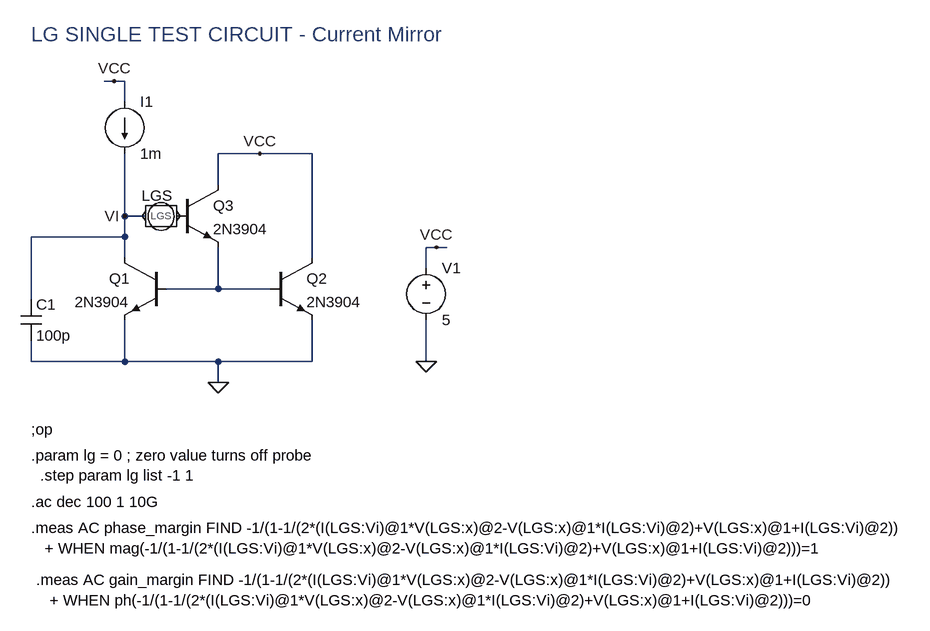
[diagram p0: schematic LG Single test circuit 1.asc]
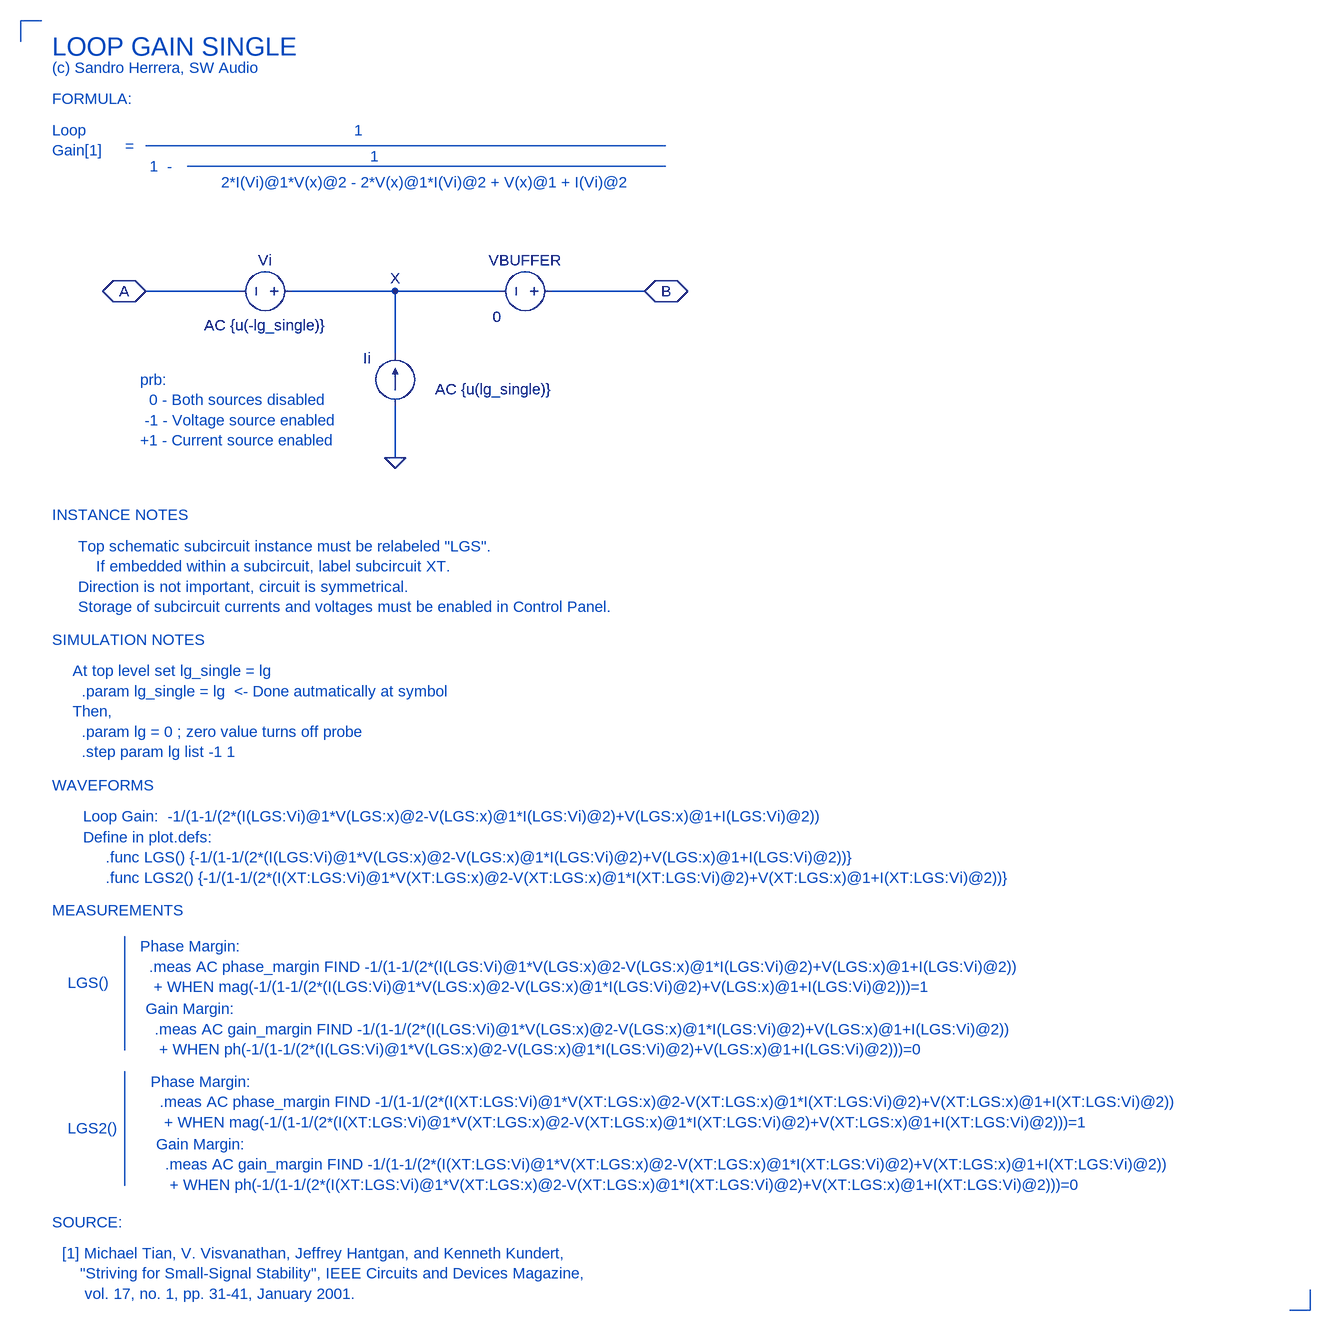
[diagram p1: sub-circuit lg_single.asc]
LG Single test circuit 1.asc, the LTspice schematic file:
Version 4
SHEET 1 1432 940
WIRE 96 128 80 128
WIRE 112 128 96 128
WIRE 112 160 112 128
WIRE 320 240 256 240
WIRE 400 240 320 240
WIRE 256 288 256 240
WIRE 112 336 112 240
WIRE 144 336 112 336
WIRE 112 368 112 336
WIRE 112 368 -32 368
WIRE 592 384 576 384
WIRE 608 384 592 384
WIRE 112 400 112 368
WIRE 400 400 400 240
WIRE 576 416 576 384
WIRE 256 448 256 384
WIRE 256 448 176 448
WIRE 336 448 256 448
WIRE -32 464 -32 368
WIRE -32 560 -32 528
WIRE 112 560 112 496
WIRE 112 560 -32 560
WIRE 256 560 112 560
WIRE 400 560 400 496
WIRE 400 560 256 560
WIRE 576 560 576 496
WIRE 256 592 256 560
FLAG 320 240 VCC
FLAG 96 128 VCC
FLAG 256 592 0
FLAG 576 560 0
FLAG 592 384 VCC
FLAG 112 336 VI
SYMBOL current 112 160 R0
WINDOW 123 0 0 Left 0
WINDOW 39 0 0 Left 0
SYMATTR InstName I1
SYMATTR Value 1m
SYMBOL npn 176 400 M0
SYMATTR InstName Q1
SYMATTR Value 2N3904
SYMBOL npn 336 400 R0
SYMATTR InstName Q2
SYMATTR Value 2N3904
SYMBOL npn 192 288 R0
SYMATTR InstName Q3
SYMATTR Value 2N3904
SYMBOL voltage 576 400 R0
WINDOW 123 0 0 Left 0
WINDOW 39 0 0 Left 0
SYMATTR InstName V1
SYMATTR Value 5
SYMBOL cap -48 464 R0
SYMATTR InstName C1
SYMATTR Value 100p
SYMBOL MySymbols\\LG_single 176 336 R0
SYMATTR InstName LGS
TEXT -32 56 Left 3 ;LG SINGLE TEST CIRCUIT - Current Mirror
TEXT -32 664 Left 2 !;op
TEXT -32 704 Left 2 !.param lg = 0 ; zero value turns off probe\n  .step param lg list -1 1
TEXT -32 776 Left 2 !.ac dec 100 1 10G
TEXT -32 816 Left 2 !.meas AC phase_margin FIND -1/(1-1/(2*(I(LGS:Vi)@1*V(LGS:x)@2-V(LGS:x)@1*I(LGS:Vi)@2)+V(LGS:x)@1+I(LGS:Vi)@2))\n   + WHEN mag(-1/(1-1/(2*(I(LGS:Vi)@1*V(LGS:x)@2-V(LGS:x)@1*I(LGS:Vi)@2)+V(LGS:x)@1+I(LGS:Vi)@2)))=1
TEXT -24 896 Left 2 !.meas AC gain_margin FIND -1/(1-1/(2*(I(LGS:Vi)@1*V(LGS:x)@2-V(LGS:x)@1*I(LGS:Vi)@2)+V(LGS:x)@1+I(LGS:Vi)@2))\n   + WHEN ph(-1/(1-1/(2*(I(LGS:Vi)@1*V(LGS:x)@2-V(LGS:x)@1*I(LGS:Vi)@2)+V(LGS:x)@1+I(LGS:Vi)@2)))=0

lg_single.asc, the sub-circuit schematic file:
Version 4
SHEET 1 1988 2148
WIRE 336 416 192 416
WIRE 576 416 416 416
WIRE 736 416 576 416
WIRE 960 416 816 416
WIRE 576 512 576 416
WIRE 576 672 576 592
FLAG 576 672 0
FLAG 192 416 A
IOPIN 192 416 BiDir
FLAG 960 416 B
IOPIN 960 416 BiDir
FLAG 576 416 X
SYMBOL current 576 592 R180
WINDOW 0 37 73 Left 2
WINDOW 3 24 0 Left 2
WINDOW 123 -243 25 Left 2
WINDOW 39 0 0 Left 0
SYMATTR InstName Ii
SYMATTR Value ""
SYMATTR Value2 AC {u(lg_single)}
SYMBOL voltage 432 416 R90
WINDOW 0 -32 56 VBottom 2
WINDOW 3 74 56 VTop 2
WINDOW 123 37 55 VTop 2
WINDOW 39 0 0 Left 0
SYMATTR InstName Vi
SYMATTR Value ""
SYMATTR Value2 AC {u(-lg_single)}
SYMBOL voltage 832 416 R90
WINDOW 0 -32 56 VBottom 2
WINDOW 3 55 99 VBottom 2
WINDOW 123 37 55 VTop 2
WINDOW 39 0 0 Left 0
SYMATTR InstName VBUFFER
SYMATTR Value 0
TEXT 48 40 Left 4 ;LOOP GAIN SINGLE
TEXT 520 168 Center 2 ;1
TEXT 544 208 Center 2 ;1
TEXT 624 248 Center 2 ;2*I(Vi)@1*V(x)@2 - 2*V(x)@1*I(Vi)@2 + V(x)@1 + I(Vi)@2
TEXT 216 224 Center 2 ;1  -
TEXT 48 168 Left 2 ;Loop\nGain[1]
TEXT 168 192 Center 2 ;=
TEXT 48 120 Left 2 ;FORMULA:
TEXT 184 552 Left 2 ;prb:\n  0 - Both sources disabled\n -1 - Voltage source enabled\n+1 - Current source enabled
TEXT 48 952 Left 2 ;SIMULATION NOTES
TEXT 80 1000 Left 2 ;At top level set lg_single = lg\n  .param lg_single = lg  <- Done autmatically at symbol \nThen,\n  .param lg = 0 ; zero value turns off probe\n  .step param lg list -1 1
TEXT 64 1896 Left 2 ;[1] Michael Tian, V. Visvanathan, Jeffrey Hantgan, and Kenneth Kundert,\n    "Striving for Small-Signal Stability", IEEE Circuits and Devices Magazine,\n     vol. 17, no. 1, pp. 31-41, January 2001.
TEXT 88 808 Left 2 ;Top schematic subcircuit instance must be relabeled "LGS".\n    If embedded within a subcircuit, label subcircuit XT.\nDirection is not important, circuit is symmetrical.\nStorage of subcircuit currents and voltages must be enabled in Control Panel.
TEXT 48 1176 Left 2 ;WAVEFORMS
TEXT 48 1848 Left 2 ;SOURCE:
TEXT 96 1224 Left 2 ;Loop Gain:  -1/(1-1/(2*(I(LGS:Vi)@1*V(LGS:x)@2-V(LGS:x)@1*I(LGS:Vi)@2)+V(LGS:x)@1+I(LGS:Vi)@2))
TEXT 96 1256 Left 2 ;Define in plot.defs:\n     .func LGS() {-1/(1-1/(2*(I(LGS:Vi)@1*V(LGS:x)@2-V(LGS:x)@1*I(LGS:Vi)@2)+V(LGS:x)@1+I(LGS:Vi)@2))}\n     .func LGS2() {-1/(1-1/(2*(I(XT:LGS:Vi)@1*V(XT:LGS:x)@2-V(XT:LGS:x)@1*I(XT:LGS:Vi)@2)+V(XT:LGS:x)@1+I(XT:LGS:Vi)@2))}
TEXT 48 760 Left 2 ;INSTANCE NOTES
TEXT 184 1424 Left 2 ;Phase Margin:\n  .meas AC phase_margin FIND -1/(1-1/(2*(I(LGS:Vi)@1*V(LGS:x)@2-V(LGS:x)@1*I(LGS:Vi)@2)+V(LGS:x)@1+I(LGS:Vi)@2))\n   + WHEN mag(-1/(1-1/(2*(I(LGS:Vi)@1*V(LGS:x)@2-V(LGS:x)@1*I(LGS:Vi)@2)+V(LGS:x)@1+I(LGS:Vi)@2)))=1
TEXT 192 1520 Left 2 ;Gain Margin:\n  .meas AC gain_margin FIND -1/(1-1/(2*(I(LGS:Vi)@1*V(LGS:x)@2-V(LGS:x)@1*I(LGS:Vi)@2)+V(LGS:x)@1+I(LGS:Vi)@2))\n   + WHEN ph(-1/(1-1/(2*(I(LGS:Vi)@1*V(LGS:x)@2-V(LGS:x)@1*I(LGS:Vi)@2)+V(LGS:x)@1+I(LGS:Vi)@2)))=0
TEXT 48 1368 Left 2 ;MEASUREMENTS
TEXT 200 1632 Left 2 ;Phase Margin:\n  .meas AC phase_margin FIND -1/(1-1/(2*(I(XT:LGS:Vi)@1*V(XT:LGS:x)@2-V(XT:LGS:x)@1*I(XT:LGS:Vi)@2)+V(XT:LGS:x)@1+I(XT:LGS:Vi)@2))\n   + WHEN mag(-1/(1-1/(2*(I(XT:LGS:Vi)@1*V(XT:LGS:x)@2-V(XT:LGS:x)@1*I(XT:LGS:Vi)@2)+V(XT:LGS:x)@1+I(XT:LGS:Vi)@2)))=1
TEXT 208 1728 Left 2 ;Gain Margin:\n  .meas AC gain_margin FIND -1/(1-1/(2*(I(XT:LGS:Vi)@1*V(XT:LGS:x)@2-V(XT:LGS:x)@1*I(XT:LGS:Vi)@2)+V(XT:LGS:x)@1+I(XT:LGS:Vi)@2))\n   + WHEN ph(-1/(1-1/(2*(I(XT:LGS:Vi)@1*V(XT:LGS:x)@2-V(XT:LGS:x)@1*I(XT:LGS:Vi)@2)+V(XT:LGS:x)@1+I(XT:LGS:Vi)@2)))=0
TEXT 72 1480 Left 2 ;LGS()
TEXT 72 1704 Left 2 ;LGS2()
TEXT 48 72 Left 2 ;(c) Sandro Herrera, SW Audio
LINE Normal 992 224 256 224
LINE Normal 0 0 0 32
LINE Normal 32 0 0 0
LINE Normal 32 0 32 0 2
LINE Normal 992 192 192 192
LINE Normal 1984 1984 1984 1952
LINE Normal 1952 1984 1984 1984
LINE Normal 1952 1984 1952 1984 2
LINE Normal 160 1584 160 1408
LINE Normal 160 1584 160 1584 2
LINE Normal 160 1792 160 1616
LINE Normal 160 1792 160 1792 2

The netlist it stands for:
* LG Single test circuit 1.asc
I1 VCC VI 1m
Q1 VI N001 0 0 2N3904
Q2 VCC N001 0 0 2N3904
Q3 VCC P001 N001 0 2N3904
V1 VCC 0 5
C1 VI 0 100p
XLGS VI P001 lg_single params: lg_single=lg

* block symbol definitions
.subckt lg_single A B
Ii 0 X AC {u(lg_single)}
Vi X A AC {u(-lg_single)}
VBUFFER B X 0
* LOOP GAIN SINGLE
* 1
* 1
* 2*I(Vi)@1*V(x)@2 - 2*V(x)@1*I(Vi)@2 + V(x)@1 + I(Vi)@2
* 1  -
* Loop
* Gain[1]
* =
* FORMULA:
* prb:
*   0 - Both sources disabled
*  -1 - Voltage source enabled
* +1 - Current source enabled
* SIMULATION NOTES
* At top level set lg_single = lg
*   .param lg_single = lg  <- Done autmatically at symbol
* Then,
*   .param lg = 0 ; zero value turns off probe
*   .step param lg list -1 1
* [1] Michael Tian, V. Visvanathan, Jeffrey Hantgan, and Kenneth Kundert,
*     "Striving for Small-Signal Stability", IEEE Circuits and Devices Magazine,
*      vol. 17, no. 1, pp. 31-41, January 2001.
* Top schematic subcircuit instance must be relabeled "LGS".
*     If embedded within a subcircuit, label subcircuit XT.
* Direction is not important, circuit is symmetrical.
* Storage of subcircuit currents and voltages must be enabled in Control Panel.
* WAVEFORMS
* SOURCE:
* Loop Gain:  -1/(1-1/(2*(I(LGS:Vi)@1*V(LGS:x)@2-V(LGS:x)@1*I(LGS:Vi)@2)+V(LGS:x)@1+I(LGS:Vi)@2))
* Define in plot.defs:
*      .func LGS() {-1/(1-1/(2*(I(LGS:Vi)@1*V(LGS:x)@2-V(LGS:x)@1*I(LGS:Vi)@2)+V(LGS:x)@1+I(LGS:Vi)@2))}
*      .func LGS2() {-1/(1-1/(2*(I(XT:LGS:Vi)@1*V(XT:LGS:x)@2-V(XT:LGS:x)@1*I(XT:LGS:Vi)@2)+V(XT:LGS:x)@1+I(XT:LGS:Vi)@2))}
* INSTANCE NOTES
* Phase Margin:
*   .meas AC phase_margin FIND -1/(1-1/(2*(I(LGS:Vi)@1*V(LGS:x)@2-V(LGS:x)@1*I(LGS:Vi)@2)+V(LGS:x)@1+I(LGS:Vi)@2))
*    + WHEN mag(-1/(1-1/(2*(I(LGS:Vi)@1*V(LGS:x)@2-V(LGS:x)@1*I(LGS:Vi)@2)+V(LGS:x)@1+I(LGS:Vi)@2)))=1
* Gain Margin:
*   .meas AC gain_margin FIND -1/(1-1/(2*(I(LGS:Vi)@1*V(LGS:x)@2-V(LGS:x)@1*I(LGS:Vi)@2)+V(LGS:x)@1+I(LGS:Vi)@2))
*    + WHEN ph(-1/(1-1/(2*(I(LGS:Vi)@1*V(LGS:x)@2-V(LGS:x)@1*I(LGS:Vi)@2)+V(LGS:x)@1+I(LGS:Vi)@2)))=0
* MEASUREMENTS
* Phase Margin:
*   .meas AC phase_margin FIND -1/(1-1/(2*(I(XT:LGS:Vi)@1*V(XT:LGS:x)@2-V(XT:LGS:x)@1*I(XT:LGS:Vi)@2)+V(XT:LGS:x)@1+I(XT:LGS:Vi)@2))
*    + WHEN mag(-1/(1-1/(2*(I(XT:LGS:Vi)@1*V(XT:LGS:x)@2-V(XT:LGS:x)@1*I(XT:LGS:Vi)@2)+V(XT:LGS:x)@1+I(XT:LGS:Vi)@2)))=1
* Gain Margin:
*   .meas AC gain_margin FIND -1/(1-1/(2*(I(XT:LGS:Vi)@1*V(XT:LGS:x)@2-V(XT:LGS:x)@1*I(XT:LGS:Vi)@2)+V(XT:LGS:x)@1+I(XT:LGS:Vi)@2))
*    + WHEN ph(-1/(1-1/(2*(I(XT:LGS:Vi)@1*V(XT:LGS:x)@2-V(XT:LGS:x)@1*I(XT:LGS:Vi)@2)+V(XT:LGS:x)@1+I(XT:LGS:Vi)@2)))=0
* LGS()
* LGS2()
* (c) Sandro Herrera, SW Audio
.ends lg_single

.model NPN NPN
.model PNP PNP
.lib standard.bjt
* LG SINGLE TEST CIRCUIT - Current Mirror
;op
.param lg = 0 ; zero value turns off probe
  .step param lg list -1 1
.ac dec 100 1 10G
.meas AC phase_margin FIND -1/(1-1/(2*(I(LGS:Vi)@1*V(LGS:x)@2-V(LGS:x)@1*I(LGS:Vi)@2)+V(LGS:x)@1+I(LGS:Vi)@2))
   + WHEN mag(-1/(1-1/(2*(I(LGS:Vi)@1*V(LGS:x)@2-V(LGS:x)@1*I(LGS:Vi)@2)+V(LGS:x)@1+I(LGS:Vi)@2)))=1
.meas AC gain_margin FIND -1/(1-1/(2*(I(LGS:Vi)@1*V(LGS:x)@2-V(LGS:x)@1*I(LGS:Vi)@2)+V(LGS:x)@1+I(LGS:Vi)@2))
   + WHEN ph(-1/(1-1/(2*(I(LGS:Vi)@1*V(LGS:x)@2-V(LGS:x)@1*I(LGS:Vi)@2)+V(LGS:x)@1+I(LGS:Vi)@2)))=0
.backanno
.end